# EAGLE design Mood-Badge (EAGLE 9.6.2)
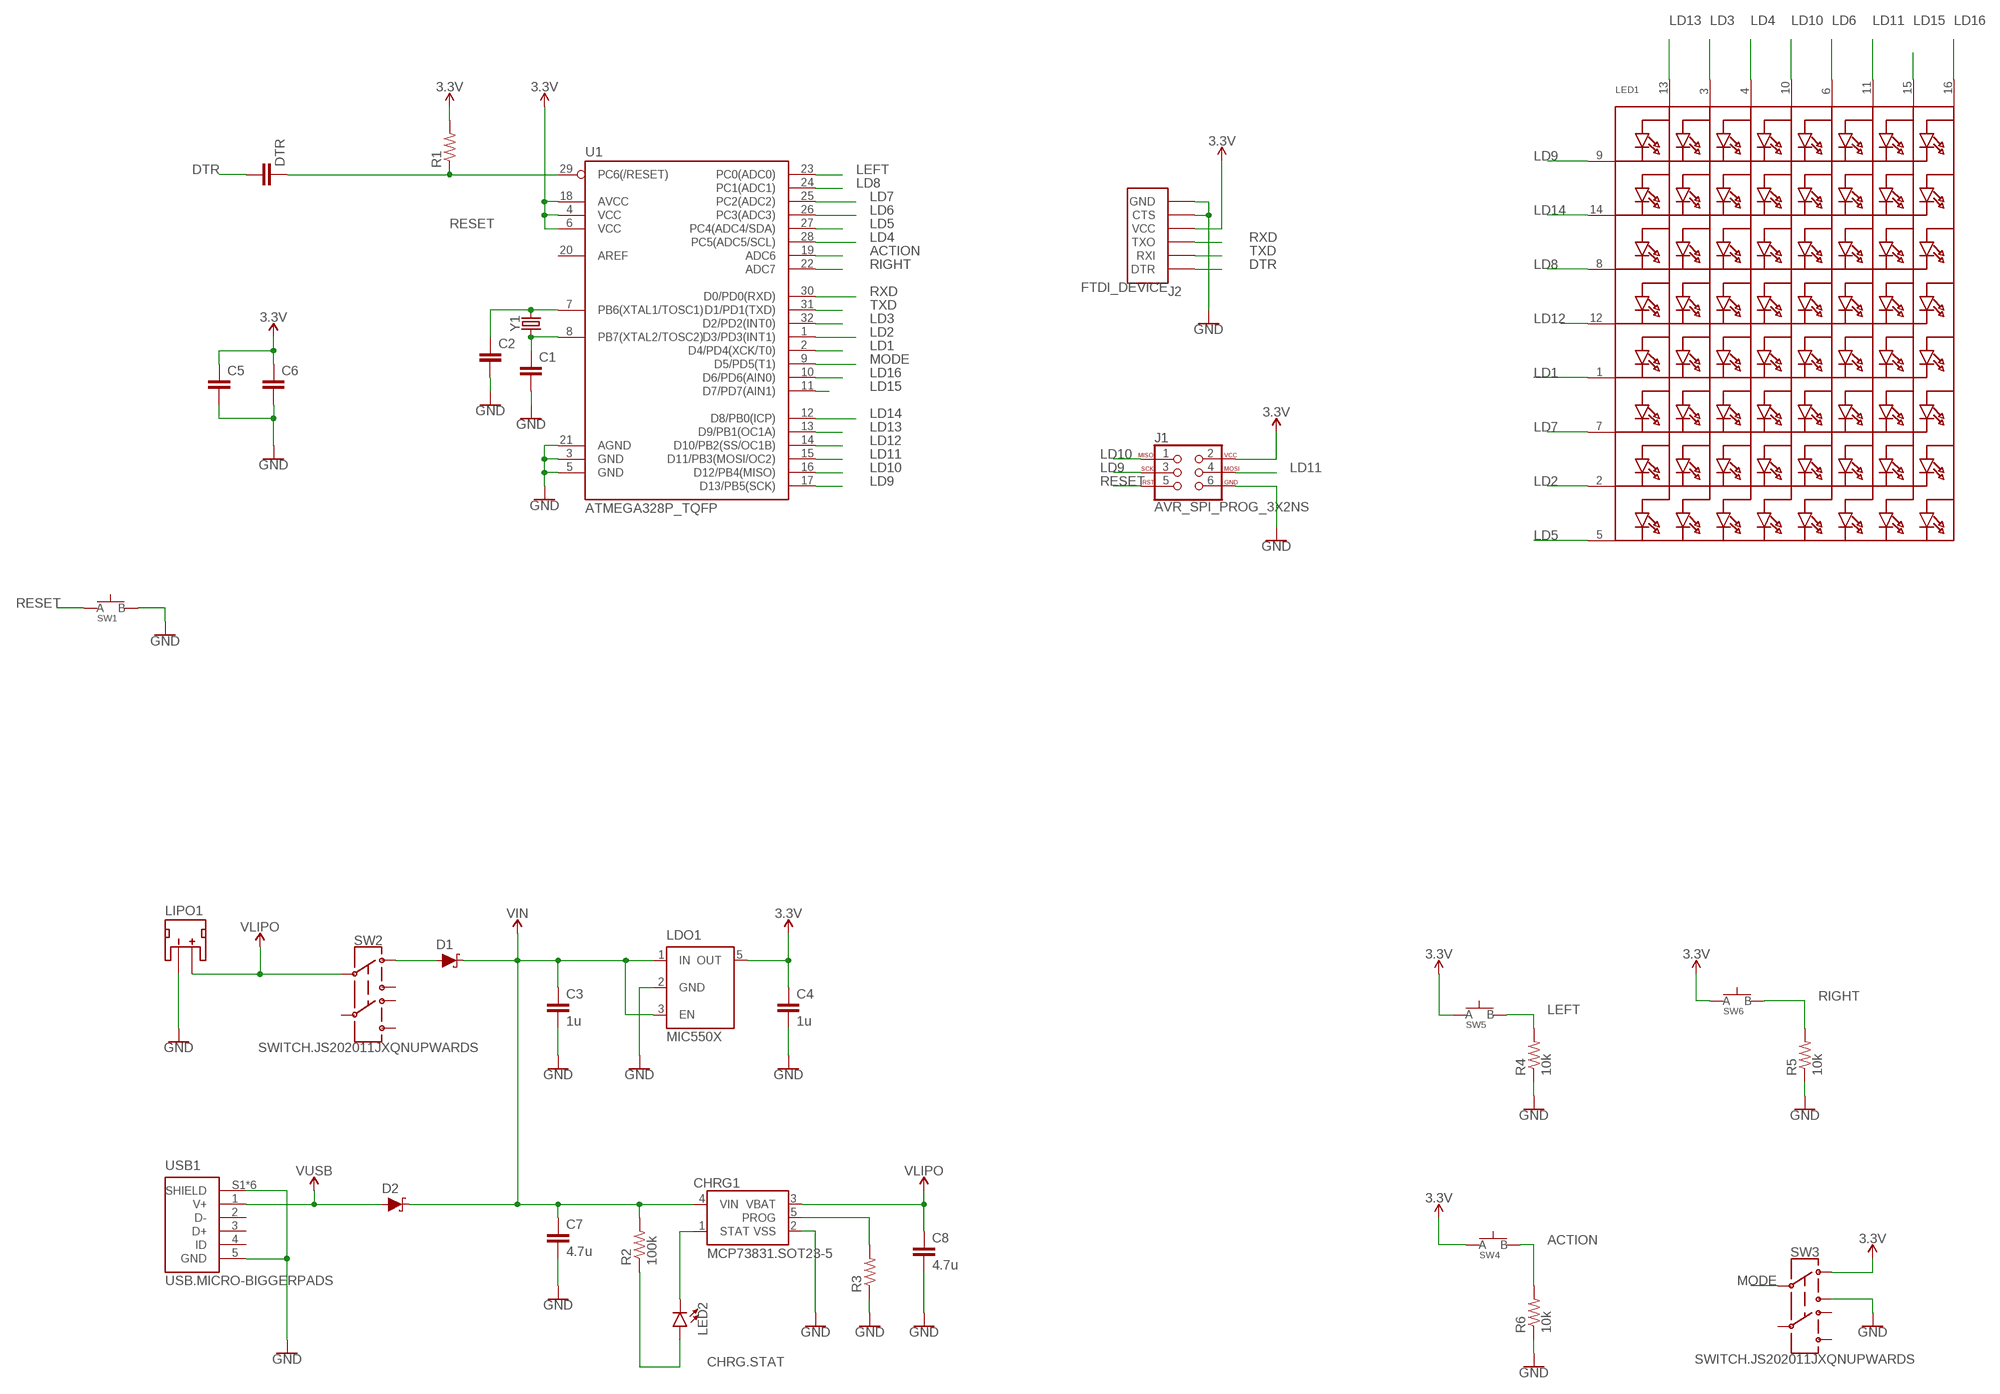
[diagram p0: schematic, sheet 1]

## Parts
C1  CAPACITOR0603  [C0603]
C2  CAPACITOR0603  [C0603]
C3  1u  CAPACITOR0603  [C0603]
C4  1u  CAPACITOR0603  [C0603]
C5  CAPACITOR0603  [C0603]
C6  CAPACITOR0603  [C0603]
C7  4.7u  CAPACITOR0603  [C0603]
C8  4.7u  CAPACITOR0603  [C0603]
CHRG1  MCP73831.SOT23-5  [SOT23-5]
D1  SCHOTTKY-USC  [USC]
D2  SCHOTTKY-USC  [USC]
DTR  CAPACITOR0603  [C0603]
J1  AVR_SPI_PROG_3X2NS  [2X3-NS]
J2  FTDI_DEVICE  [FTDI_DEVICE]
LDO1  MIC550X  [SOT23-5]
LED1  DOTMATRIX_8X8_ROWCATHODEM12A881UR  [DOTMATRIX_BL-M12A881UR]
LED2  LED0805  [LED-0805]
LIPO1  JST_2MM_MALE  [JST-2-SMD]
R1  RESISTOR0603  [R0603]
R2  100k  RESISTOR0603  [R0603]
R3  RESISTOR0603  [R0603]
R4  10k  RESISTOR0603  [R0603]
R5  10k  RESISTOR0603  [R0603]
R6  10k  RESISTOR0603  [R0603]
SW1  SPST.KT11P4SM34LFS  [SPST.KT11P4SM34LFS]
SW2  SWITCH.JS202011JXQNUPWARDS  [SWITCH.00]
SW3  SWITCH.JS202011JXQNUPWARDS  [SWITCH.00]
SW4  SPST.KT11P4SM34LFS  [SPST.KT11P4SM34LFS]
SW5  SPST.KT11P4SM34LFS  [SPST.KT11P4SM34LFS]
SW6  SPST.KT11P4SM34LFS  [SPST.KT11P4SM34LFS]
U1  ATMEGA328P_TQFP  [TQFP32-08]
USB1  USB.MICRO-BIGGERPADS  [USB-MICRO-01.BIGGERPADS]
Y1  CRYSTAL-CA-310  [CA-301]

## Nets
3.3V: C4.1 C5.1 C6.1 J1.2 J2.VCC LDO1.5(OUT) R1.2 SW3.1 SW4.1(A) SW4.2(A) SW5.1(A) SW5.2(A) SW6.1(A) SW6.2(A) U1.4(VCC) U1.6(VCC) U1.18(AVCC)
ACTION: R6.2 SW4.3(B) SW4.4(B) U1.19(ADC6)
CHRG.STAT: LED2.A R2.1
DTR: DTR.1 J2.DTR
GND: C1.2 C2.2 C3.2 C4.2 C5.2 C6.2 C7.2 C8.2 CHRG1.2(VSS) J1.6 J2.CTS J2.GND LDO1.2(GND) LIPO1.1(-) R3.1 R4.1 R5.1 R6.1 SW1.3(B) SW1.4(B) SW3.3 U1.3(GND) U1.5(GND) U1.21(AGND) USB1.5(GND) USB1.S1(SHIELD) USB1.S2(SHIELD) USB1.S3(SHIELD) USB1.S4(SHIELD) USB1.S5(SHIELD) USB1.S6(SHIELD)
LD1: LED1.1(K5) U1.2(D4/PD4(XCK/T0))
LD2: LED1.2(K7) U1.1(D3/PD3(INT1))
LD3: LED1.3(A2) U1.32(D2/PD2(INT0))
LD4: LED1.4(A3) U1.28(PC5(ADC5/SCL))
LD5: LED1.5(K8) U1.27(PC4(ADC4/SDA))
LD6: LED1.6(A5) U1.26(PC3(ADC3))
LD7: LED1.7(K6) U1.25(PC2(ADC2))
LD8: LED1.8(K3) U1.24(PC1(ADC1))
LD9: J1.3 LED1.9(K1) U1.17(D13/PB5(SCK))
LD10: J1.1 LED1.10(A4) U1.16(D12/PB4(MISO))
LD11: J1.4 LED1.11(A6) U1.15(D11/PB3(MOSI/OC2))
LD12: LED1.12(K4) U1.14(D10/PB2(SS/OC1B))
LD13: LED1.13(A1) U1.13(D9/PB1(OC1A))
LD14: LED1.14(K2) U1.12(D8/PB0(ICP))
LD15: LED1.15(A7) U1.11(D7/PD7(AIN1))
LD16: LED1.16(A8) U1.10(D6/PD6(AIN0))
LEFT: R4.2 SW5.3(B) SW5.4(B) U1.23(PC0(ADC0))
MODE: SW3.2 U1.9(D5/PD5(T1))
N$1: C1.1 U1.8(PB7(XTAL2/TOSC2)) Y1.1
N$2: CHRG1.1(STAT) LED2.C
N$3: D1.+(A) SW2.1
N$4: C2.1 U1.7(PB6(XTAL1/TOSC1)) Y1.2
N$5: CHRG1.5(PROG) R3.2
RESET: DTR.2 J1.5 R1.1 SW1.1(A) SW1.2(A) U1.29(PC6(/RESET))
RIGHT: R5.2 SW6.3(B) SW6.4(B) U1.22(ADC7)
RXD: J2.RXI(TXO) U1.30(D0/PD0(RXD))
TXD: J2.TXO(RXI) U1.31(D1/PD1(TXD))
V_USB: D2.+(A) USB1.1(V+) ; supply symbol labelled VUSB
VIN: C3.1 C7.1 CHRG1.4(VIN) D1.-(C) D2.-(C) LDO1.1(IN) LDO1.3(EN) R2.2
VLIPO: C8.1 CHRG1.3(VBAT) LIPO1.2(+) SW2.2
Unconnected: LIPO1.NC1(PAD1) LIPO1.NC2(PAD2) SW2.3 SW2.5 SW2.6 SW2.7 SW3.5 SW3.6 SW3.7 U1.20(AREF) USB1.2(D-) USB1.3(D+) USB1.4(ID)

## Library data of the parts
C1-C8 DTR = LinnesLab-Passives:CAPACITOR
CHRG1 = LinnesLab-Power:MCP73831
D1 D2 = LinnesLab-DiscreteSemi:SCHOTTKY: Schottky diode A Schottky diode is a semiconductor diode which has a low forward voltage drop and a very fast switching action. Example: Digi-Key Part Number: RB161MM-20CT-ND CST2 footprint - Manufacturer Part Number: CTS05S40,L3F
J1 = LinnesLab-Connectors:AVR_SPI_PROG_3X2: AVR ISP 6 Pin This is the reduced ISP connector for AVR programming. Common on Arduino. This footprint will take up less PCB space and can be used with a 10-pin to 6-pin adapter such as SKU: BOB-08508 **Special note about "TEST_POINT" package. The stop mask is on the top side, so if you want your programming test points to be on the bottom of your board, make sure to place this package on the bottom side of the board. This also ensure that the orientation to program from the bottom side will be correct. SparkFun Products: SparkFun ISP Pogo Adapter <https://www.sparkfun.com/products/11591> - NS Tiny AVR Programmer <https://www.sparkfun.com/products/11801> -PTH
J2 = LinnesLab-Connectors:FTDI_DEVICE
LDO1 = LinnesLab-Power:MIC550X: MIC5504 Voltage Regulator Output Voltages: 1.0V to 3.3V Input Voltages: 2.5V to 5.5V Link to Datasheet http://ww1.microchip.com/downloads/en/DeviceDoc/MIC550X.pdf
LED1 = LinnesLab-Displays:DOTMATRIX_8X8_ROWCATHODE: 8x8 LED Segment Displays: Row = Cathode 0.7" Red 8X8 Matrix, 1.9mm Round LEDs - BL-M07C881UR 1.2" Red 8x8 Matrix, 3.0mm Round LEDs - BL-M12A881UR 1.2" Red 8x8 Matrix, 3.0mm Square LEDs - BL-M12A883
LED2 = LinnesLab-LED:LED: LED (Generic) Standard schematic elements and footprints for 5mm, 3mm, 1206, and 0603 sized LEDs. Generic LEDs with no color specified. LTST-C190KGKT: arrow indicates cathode
LIPO1 = LinnesLab-Connectors:JST_2MM_MALE: JST 2MM MALE RA CONNECTOR Two pin, compact surface mount connector. Commonly used as a battery input connection point. We really like the solid locking feeling and high current rating on these small connectors. We use these all the time as battery connectors. Mates to single-cell LiPo batteries. Here is the connector we sell at SparkFun: JST Right Angle Connector - White <https://www.sparkfun.com/products/8612> (PRT-08612) Datasheet <http://www.sparkfun.com/datasheets/Prototyping/Connectors/JST-Horizontal.pdf> It was used on these SparkFun products: SparkFun MOSFET Power Controller <https://www.sparkfun.com/products/11214> (PRT-11214) SparkFun Battery Babysitter - LiPo Battery Manager <https://www.sparkfun.com/products/13777> (PRT-13777) And many, many others that required a lipo battery connection.; PROD_ID: CONN-11443; SF_ID: PRT-08612
R1-R6 = LinnesLab-Passives:RESISTOR
SW1 SW4-SW6 = LinnesLab-Switches:SPST.KT11P4SM34LFS: https://www.ckswitches.com/media/1468/kt.pdf
SW2 SW3 = LinnesLab-Switches:SWITCH.JS202011JXQN: Manufacturer's Part Numer: JS202011JAQN for right angle throw JS202011JCQN for top side throw
U1 = LinnesLab-Microcontrollers:ATMEGA328P_TQFP: Popular 328P in QFP Storefront component: ATmega328 - TQFP <https://www.sparkfun.com/products/13448> (COM-13448) Datasheet <http://www.sparkfun.com/datasheets/Components/SMD/ATMega328.pdf> SparkFun Products SparkFun RedBoard - Programmed with Arduino <https://www.sparkfun.com/products/12757> (DEV-12757) Arduino Pro Mini 328 - 5V/16MHz <https://www.sparkfun.com/products/11113> (DEV-11113) Arduino Pro Mini 328 - 3.3V/8MHz <https://www.sparkfun.com/products/11114> (DEV-11114) SparkFun OpenLog <https://www.sparkfun.com/products/13712> (DEV-13712) SparkFun MicroView - OLED Arduino Module <https://www.sparkfun.com/products/12923> (DEV-12923) SparkFun Digital Sandbox <https://www.sparkfun.com/products/12651> (DEV-12651) SparkFun PicoBoard <https://www.sparkfun.com/products/11888> (WIG-11888) Arduino Fio <https://www.sparkfun.com/products/10116> (DEV-10116) LilyPad Arduino 328 Main Board <https://www.sparkfun.com/products/13342> (DEV-13342) SparkFun RedStick <https://www.sparkfun.com/products/13741> (DEV-13741) LilyPad MP3 <https://www.sparkfun.com/products/11013> (DEV-11013) LilyPad Arduino SimpleSnap <https://www.sparkfun.com/products/10941> (DEV-10941) SparkFun Stepoko <https://www.sparkfun.com/products/13899> (ROB-13899) SparkFun Geiger Counter <https://www.sparkfun.com/products/11345> (SEN-11345) SparkFun EL Sequencer <https://www.sparkfun.com/products/12781> (COM-12781) Arduino Pro 328 - 5V/16MHz <https://www.sparkfun.com/products/10915> (DEV-10915) CryptoCape <https://www.sparkfun.com/products/12773> (DEV-12773) SparkFun IR Thermometer Evaluation Board - MLX90614 <https://www.sparkfun.com/products/10740> (SEN-10740) SparkFun RedBot Mainboard <https://www.sparkfun.com/products/12097> (ROB-12097) Arduino Pro 328 - 3.3V/8MHz <https://www.sparkfun.com/products/10914> (DEV-10914) SparkFun Block for Intel® Edison - Arduino <https://www.sparkfun.com/products/13036> (DEV-13036) SparkFun Simon Says - Surface Mount Soldering Kit <https://www.sparkfun.com/products/10935> (KIT-10935) SparkFun 7-Segment Serial Display - Red <https://www.sparkfun.com/products/11441> (COM-11441) SparkFun 7-Segment Serial Display - White <https://www.sparkfun.com/products/11629> (COM-11629) SparkFun 7-Segment Serial Display - Yellow <https://www.sparkfun.com/products/11443> (COM-11443) SparkFun 7-Segment Serial Display - Kelly Green <https://www.sparkfun.com/products/11440> (COM-11440) SparkFun 7-Segment Serial Display - Blue <https://www.sparkfun.com/products/11442> (COM-11442) SparkFun OpenSegment Serial Display - 20mm (Blue) <https://www.sparkfun.com/products/11647> (COM-11647) SparkFun OpenSegment Serial Display - 20mm (Green) <https://www.sparkfun.com/products/11646> (COM-11646) SparkFun OpenSegment Serial Display - 20mm (White) <https://www.sparkfun.com/products/11648> (COM-11648) SparkFun OpenSegment Serial Display - 20mm (Red) <https://www.sparkfun.com/products/11644> (COM-11644) SparkFun OpenSegment Serial Display - 20mm (Yellow) <https://www.sparkfun.com/products/11645> (COM-11645) SparkFun OpenSegment Shield <https://www.sparkfun.com/products/13190> (DEV-13190); PROD_ID: IC-09069
USB1 = LinnesLab-Connectors:USB.MICRO: DigiKey PN: 609-4613-1-ND
Y1 = LinnesLab-Clocks:CRYSTAL-CA-310

## Board
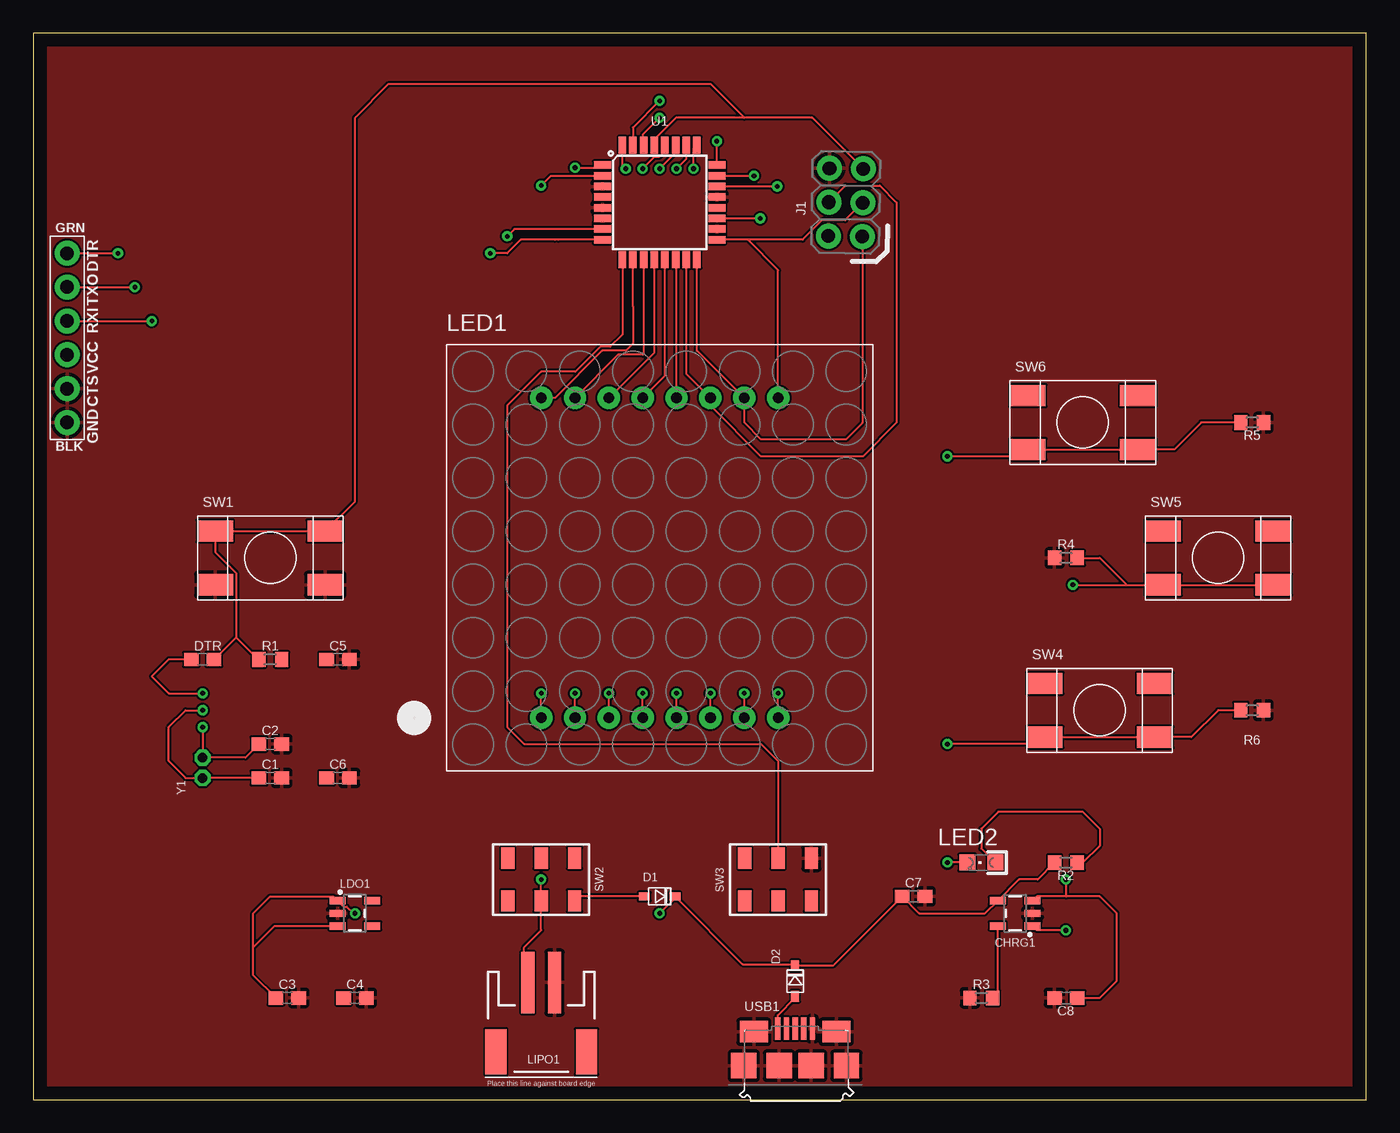
[diagram p1: board, top side]
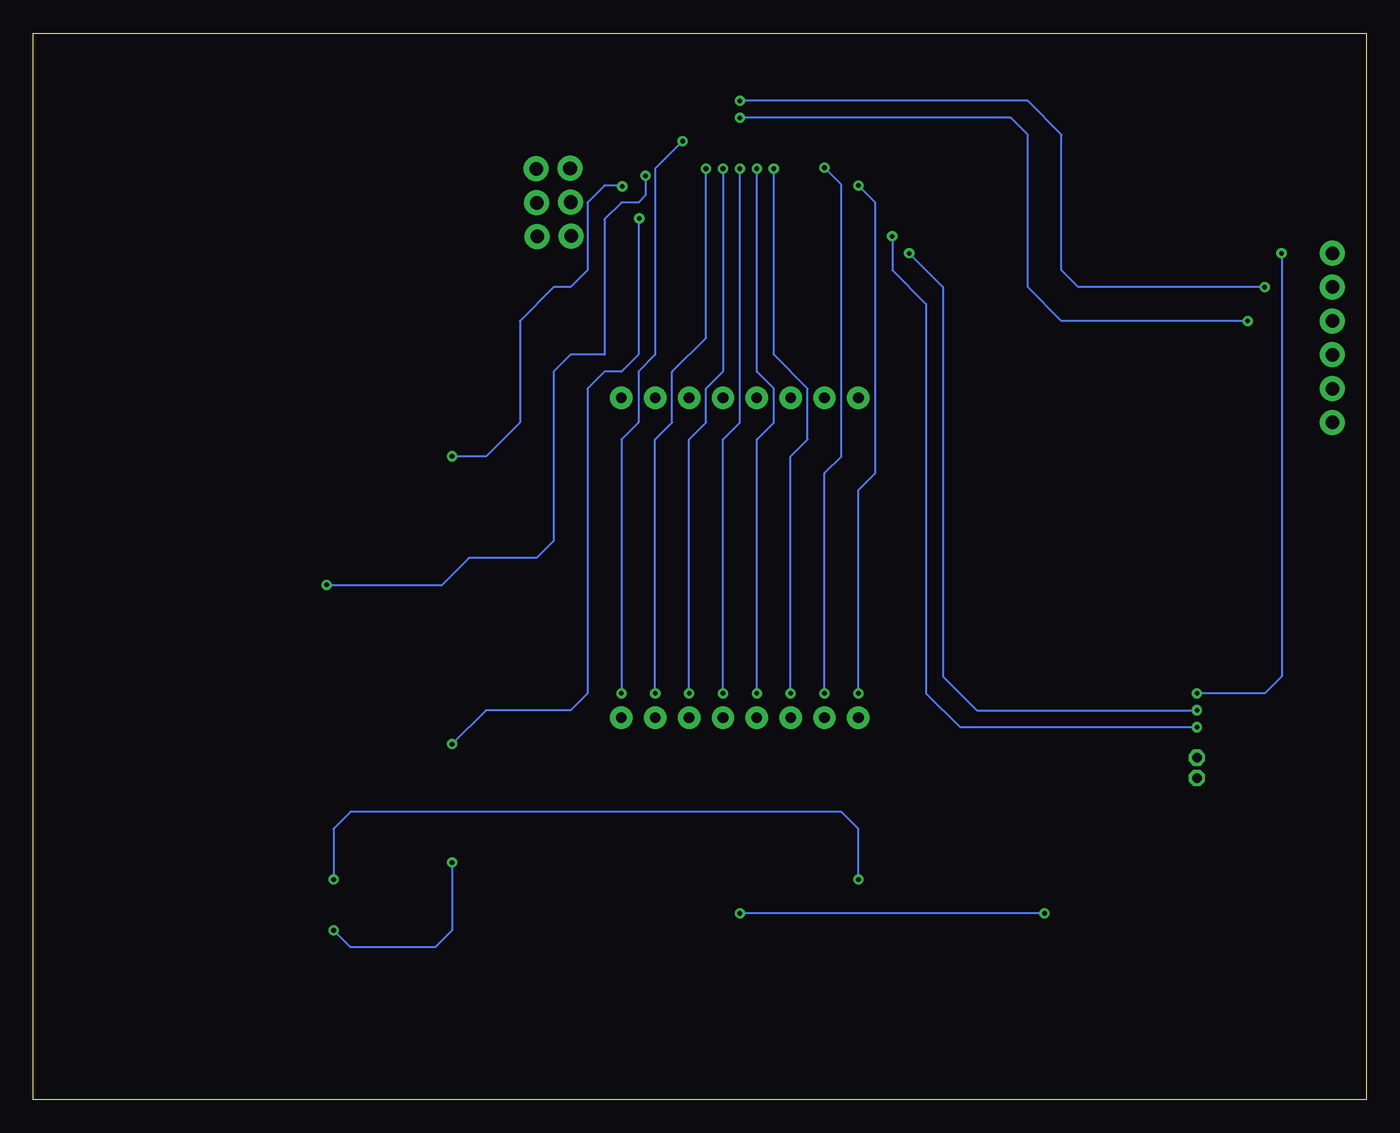
[diagram p2: board, bottom side, seen from below]

Size 100 x 80 mm. Coordinates in mm from the lower left corner, seen from the top.
Outline: 0,0 100,0 100,80 0,80 0,0
Copper layers (1*16): Top 0.035mm / dielectric 1.5mm / Bottom 0.035mm
Design rules "default": minimum track width 6mil, minimum drill 0.35mm, track to track 6mil, track to pad 6mil, pad to pad 6mil, via to via 6mil, smd to smd 6mil, copper to edge 40mil, drill to drill 6mil, minimum pad ring 10mil, minimum via ring 8mil, stop-mask expansion 4mil, vias tented up to drill 0mil, thermal gap 10mil

### Footprints (pad centres in the part's own frame; a part is rotated, then mirrored left to right if it is on the bottom)
C0603 = smd 1.1 x 1: 1 -0.85,0; 2 0.85,0
SOT23-5 = smd 0.55 x 1.2: 1 -0.95,-1.3; 2 0,-1.3; 3 0.95,-1.3; 4 0.95,1.3; 5 -0.95,1.3
USC = smd 0.8 x 0.6: + -1.15,0; - 1.15,0
2X3-NS = drill 1.016 pad 1.88: 1 -2.54,-1.27; 2 -2.54,1.27; 3 0,-1.27; 4 0,1.27; 5 2.54,-1.27; 6 2.54,1.27
FTDI_DEVICE = drill 1.016 pad 1.88: CTS 3.81,0; DTR -6.35,0; GND 6.35,0; RXI -1.27,0; TXO -3.81,0; VCC 1.27,0
DOTMATRIX_BL-M12A881UR = drill 0.8 pad 1.676: 1 -8.89,-12; 2 -6.35,-12; 3 -3.81,-12; 4 -1.27,-12; 5 1.27,-12; 6 3.81,-12; 7 6.35,-12; 8 8.89,-12; 9 8.89,12; 10 6.35,12; 11 3.81,12; 12 1.27,12; 13 -1.27,12; 14 -3.81,12; 15 -6.35,12; 16 -8.89,12
LED-0805 = smd 1.2 x 1.2: A 0,-1.05; C 0,1.05
JST-2-SMD = smd 1 x 4.6: 1 -1,-3.7; 2 1,-3.7 | smd 1.6 x 3.4: NC1 -3.4,1.5; NC2 3.4,1.5
R0603 = smd 1 x 1.1: 1 -0.85,0; 2 0.85,0
SPST.KT11P4SM34LFS = smd 2.665 x 1.59: 1 -4.128,2.02; 2 4.128,2.02; 3 -4.128,-2.02; 4 4.128,-2.02
SWITCH.00 = smd 1 x 1.6: 1 -2.5,1.6; 2 0,1.6; 3 2.5,1.6; 5 -2.5,-1.6; 6 0,-1.6; 7 2.5,-1.6
TQFP32-08 = smd 1.27 x 0.559: 1 -4.293,2.8; 2 -4.293,2; 3 -4.293,1.2; 4 -4.293,0.4; 5 -4.293,-0.4; 6 -4.293,-1.2; 7 -4.293,-2; 8 -4.293,-2.8; 17 4.293,-2.8; 18 4.293,-2; 19 4.293,-1.2; 20 4.293,-0.4; 21 4.293,0.4; 22 4.293,1.2; 23 4.293,2; 24 4.293,2.8 | smd 0.559 x 1.27: 9 -2.8,-4.293; 10 -2,-4.293; 11 -1.2,-4.293; 12 -0.4,-4.293; 13 0.4,-4.293; 14 1.2,-4.293; 15 2,-4.293; 16 2.8,-4.293; 25 2.8,4.293; 26 2,4.293; 27 1.2,4.293; 28 0.4,4.293; 29 -0.4,4.293; 30 -1.2,4.293; 31 -2,4.293; 32 -2.8,4.293
USB-MICRO-01.BIGGERPADS = smd 0.4 x 1.7: 1 -1.3,1.505; 2 -0.65,1.505; 3 0,1.505; 4 0.65,1.505; 5 1.3,1.505 | smd 1.9 x 1.9: S1 -3.85,-1.27; S2 -1.2,-1.27; S3 1.2,-1.27; S4 3.85,-1.27 | smd 2.1 x 1.6: S5 -3.1,1.28; S6 3.1,1.28
CA-301 = drill 0.711 octagon: 1 0,0; 2 1.524,0

### Placement (x,y rotation side)
C1  17.78,24.13 0 top
C2  17.78,26.67 0 top
C3  19.05,7.62 0 top
C4  24.13,7.62 0 top
C5  22.86,33.02 0 top
C6  22.86,24.13 0 top
C7  66.04,15.24 0 top
C8  77.47,7.62 180 top
CHRG1  73.66,13.97 90 top
D1  46.99,15.24 0 top
D2  57.15,8.89 90 top
DTR  12.7,33.02 0 top
J1  60.96,67.31 89.1 top
J2  2.54,57.15 270 top
LDO1  24.13,13.97 270 top
LED1  46.99,40.64 0 top
LED2  71.12,17.78 90 top
LIPO1  38.1,5.08 180 top
R1  17.78,33.02 0 top
R2  77.47,17.78 180 top
R3  71.12,7.62 0 top
R4  77.47,40.64 0 top
R5  91.44,50.8 180 top
R6  91.44,29.21 180 top
SW1  17.78,40.64 0 top
SW2  38.1,16.51 180 top
SW3  55.88,16.51 0 top
SW4  80.01,29.21 0 top
SW5  88.9,40.64 0 top
SW6  78.74,50.8 0 top
U1  46.99,67.31 0 top
USB1  57.15,3.81 0 top
Y1  12.7,24.13 90 top

### Tracks (layer width: path | path; a pad name or v marks a point on that pad's centre or on a via)
3.3V
  pour Top (rank 2): 1.27,78.74 96.52,78.74 99.06,76.2 99.06,1.27 97.79,0 0,0 0,77.47
ACTION  (via drill 0.35)
  Top 0.152: R6.2 88.9,29.21 86.88,27.19 SW4.4 SW4.3 75.36,26.67 v68.58,26.67 | v54.54,66.11 U1.19
  Bottom 0.152: v68.58,26.67 66.04,29.21 59.69,29.21 58.42,30.48 58.42,53.34 57.15,54.61 55.88,54.61 54.61,55.88 54.61,66.04 v54.54,66.11
CHRG.STAT
  Top 0.152: LED2.A 71.12,18.83 71.12,20.32 72.39,21.59 78.74,21.59 80.01,20.32 80.01,19.05 78.74,17.78 R2.1
DTR  (via drill 0.35)
  Top 0.152: J2.DTR v6.35,63.5 | DTR.1 10.16,33.02 8.89,31.75 10.16,30.48 v12.7,30.48
  Bottom 0.152: v6.35,63.5 6.35,31.75 7.62,30.48 v12.7,30.48
GND
  pour Top: 0,0 0,80.01 1.27,80.01 99.06,80.01 99.06,1.27 99.06,0
LD1  (via drill 0.35)
  Top 0.152: LED1.1 v38.1,30.48 | v38.1,68.58 38.83,69.31 U1.2
  Bottom 0.152: v38.1,30.48 38.1,45.72 36.83,46.99 36.83,67.31 v38.1,68.58
LD2  (via drill 0.35)
  Top 0.152: LED1.2 v40.64,30.48 | v40.64,69.92 42.5,69.92 U1.1
  Bottom 0.152: v40.64,30.48 40.64,46.99 39.37,48.26 39.37,68.65 v40.64,69.92
LD3  (via drill 0.35)
  Top 0.152: LED1.3 v43.18,30.48 | v44.45,69.85 44.19,70.11 U1.32
  Bottom 0.152: v43.18,30.48 43.18,48.26 41.91,49.53 41.91,53.34 44.45,55.88 v44.45,69.85
LD4  (via drill 0.35)
  Top 0.152: LED1.4 v45.72,30.48 | v45.72,69.85 46.61,70.74 46.96,70.74 47.39,71.17 U1.28
  Bottom 0.152: v45.72,30.48 45.72,49.53 44.45,50.8 44.45,53.34 45.72,54.61 v45.72,69.85
LD5  (via drill 0.35)
  Top 0.152: LED1.5 v48.26,30.48 | v46.99,69.85 48.19,71.05 U1.27
  Bottom 0.152: v48.26,30.48 48.26,49.53 46.99,50.8 v46.99,69.85
LD6  (via drill 0.35)
  Top 0.152: LED1.6 v50.8,30.48 | v48.26,69.85 48.99,70.58 U1.26
  Bottom 0.152: v50.8,30.48 50.8,49.53 49.53,50.8 49.53,53.34 48.26,54.61 v48.26,69.85
LD7  (via drill 0.35)
  Top 0.152: LED1.7 v53.34,30.48 | v49.53,69.85 49.53,71.34 U1.25
  Bottom 0.152: v53.34,30.48 53.34,49.53 52.07,50.8 52.07,54.61 49.53,57.15 v49.53,69.85
LD8  (via drill 0.35)
  Top 0.152: LED1.8 v55.88,30.48 | U1.24 v51.28,71.91
  Bottom 0.152: v55.88,30.48 55.88,49.53 54.61,50.8 54.61,54.61 53.34,55.88 53.34,69.85 v51.28,71.91
LD9
  Top 0.152: LED1.9 55.88,62.23 53.6,64.51 U1.17 57.71,64.51 59.16,65.97 60.91,65.97 J1.3
LD10
  Top 0.152: U1.16 49.79,56.19 LED1.10 53.34,50.8 54.61,49.53 60.96,49.53 62.19,50.76 J1.1
LD11
  Top 0.152: U1.15 48.99,54.45 LED1.11 50.8,52.07 54.61,48.26 62.23,48.26 64.77,50.8 64.77,67.31 63.5,68.58 60.94,68.58 J1.4
LD12
  Top 0.152: LED1.12 48.26,62.95 U1.14
LD13
  Top 0.152: LED1.13 47.39,54.31 U1.13
LD14
  Top 0.152: LED1.14 46.59,56.05 U1.12
LD15
  Top 0.152: U1.11 45.79,55.95 45.72,55.88 43.88,55.88 LED1.15
LD16
  Top 0.152: U1.10 44.99,59.69 44.99,59.53 44.99,56.73 44.45,56.19 42.68,56.19 39.13,52.64 LED1.16
LEFT  (via drill 0.35)
  Top 0.152: R4.2 80.01,40.64 82.03,38.62 | 82.03,38.62 SW5.3 SW5.4 | U1.23 v54.07,69.31 | v77.99,38.62 82.03,38.62
  Bottom 0.152: v77.99,38.62 69.33,38.62 67.31,40.64 62.23,40.64 60.96,41.91 60.96,54.61 59.69,55.88 57.15,55.88 57.15,66.04 55.88,67.31 54.61,67.31 54.07,67.85 v54.07,69.31
MODE
  Top 0.152: U1.9 44.19,57.41 43.27,56.49 42.55,56.49 40.67,54.61 38.1,54.61 35.56,52.07 35.56,27.94 36.83,26.67 54.61,26.67 55.88,25.4 SW3.2
N$1  (via drill 0.35)
  Top 0.152: C1.1 Y1.1 11.43,24.13 10.16,25.4 10.16,27.94 11.43,29.21 v12.7,29.21 | U1.8 39.37,64.51 39.11,64.51 36.57,64.51 35.56,63.5 v34.29,63.5
  Bottom 0.152: v12.7,29.21 29.21,29.21 31.75,31.75 31.75,60.96 v34.29,63.5
N$2  (via drill 0.35)
  Top 0.152: LED2.C v68.58,17.78 | v77.47,12.7 75.28,12.7 CHRG1.1
  Bottom 0.152: v68.58,17.78 68.58,12.7 69.85,11.43 76.2,11.43 v77.47,12.7
N$3
  Top 0.152: SW2.1 40.6,15.24 D1.+
N$4  (via drill 0.35)
  Top 0.152: C2.1 15.91,25.65 Y1.2 v12.7,27.94 | U1.7 36.1,65.31 v35.56,64.77
  Bottom 0.152: v35.56,64.77 35.56,62.23 33.02,59.69 33.02,30.48 30.48,27.94 v12.7,27.94
N$5
  Top 0.152: R3.2 72.36,8.01 CHRG1.5
RESET
  Top 0.152: J1.5 58.44,73.66 53.34,73.66 | U1.29 46.59,72.04 48.21,73.66 53.34,73.66 | 15.21,34.68 15.21,39.51 13.65,41.07 SW1.1 SW1.2 24.13,44.88 24.13,73.66 26.67,76.2 50.8,76.2 53.34,73.66 | 15.21,34.68 DTR.2 | R1.1 16.88,33.02 15.21,34.68
RIGHT  (via drill 0.35)
  Top 0.152: R5.2 87.63,50.8 85.61,48.78 SW6.4 SW6.3 74.09,48.26 v68.58,48.26 | v55.81,68.51 U1.22
  Bottom 0.152: v55.81,68.51 55.88,68.58 57.15,68.58 58.42,67.31 58.42,62.23 59.69,60.96 60.96,60.96 63.5,58.42 63.5,50.8 66.04,48.26 v68.58,48.26
RXD  (via drill 0.35)
  Top 0.152: J2.RXI v8.89,58.42 | v46.99,73.66 45.72,72.39 45.72,71.67 U1.30
  Bottom 0.152: v46.99,73.66 26.67,73.66 25.4,72.39 25.4,60.96 22.86,58.42 v8.89,58.42
TXD  (via drill 0.35)
  Top 0.152: J2.TXO v7.62,60.96 | v46.99,74.93 44.99,72.93 U1.31
  Bottom 0.152: v46.99,74.93 25.4,74.93 22.86,72.39 22.86,62.23 21.59,60.96 v7.62,60.96
V_USB
  Top 0.152: USB1.1 55.85,6.32 57.15,7.62 D2.+
VIN  (via drill 0.35)
  Top 0.152: C3.1 16.51,9.31 16.51,11.43 | 16.51,11.43 16.51,13.97 17.78,15.24 22.51,15.24 LDO1.1 23.28,14.47 23.52,14.47 24.03,13.97 v24.13,13.97 | LDO1.3 18.1,13.02 16.51,11.43 | D1.- 48.2,15.18 | 48.2,15.18 53.22,10.16 57.03,10.16 D2.- 59.99,10.04 C7.1 66.46,13.97 71.41,13.97 CHRG1.4 73.95,16.51 75.35,16.51 R2.2 | v46.99,13.97 48.2,15.18
  Bottom 0.152: v24.13,13.97 v46.99,13.97
VLIPO  (via drill 0.35)
  Top 0.152: LIPO1.2 36.83,9.05 36.83,11.43 38.1,12.7 SW2.2 v38.1,16.51 | C8.1 80.01,7.62 81.28,8.89 81.28,13.97 80.01,15.24 77.47,15.24 | 77.47,15.24 75.28,15.24 CHRG1.3 | v77.47,16.51 77.47,15.24
  Bottom 0.152: v38.1,16.51 38.1,20.32 39.37,21.59 76.2,21.59 77.47,20.32 v77.47,16.51